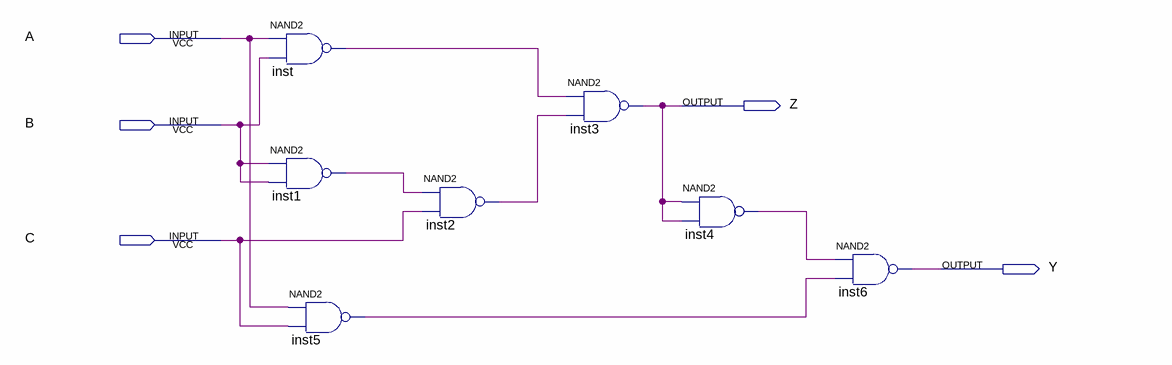
[diagram p0: schematic sheet]
// Quartus schematic Lab1_Schematic.bdf as structural Verilog: 7 symbols, 5 pins
module Lab1_Schematic (
  input  A,
  input  B,
  input  C,
  output Z,
  output Y
);

  wire inst1_out, inst2_out, inst4_out, inst5_out, inst_out;

  nand inst (inst_out, A, B);
  nand inst1 (inst1_out, B, B);
  nand inst5 (inst5_out, A, C);
  nand inst2 (inst2_out, inst1_out, C);
  nand inst3 (Z, inst_out, inst2_out);
  nand inst4 (inst4_out, Z, Z);
  nand inst6 (Y, inst4_out, inst5_out);
endmodule
